# EasyEDA schematic 1-Schematic_5G8038.json
TITLE: 5G8038; REV: 1.0; Date: 2022-07-19; Sheet: 1/1; Drawn By: BH2VGM; Company: NEU-ISE
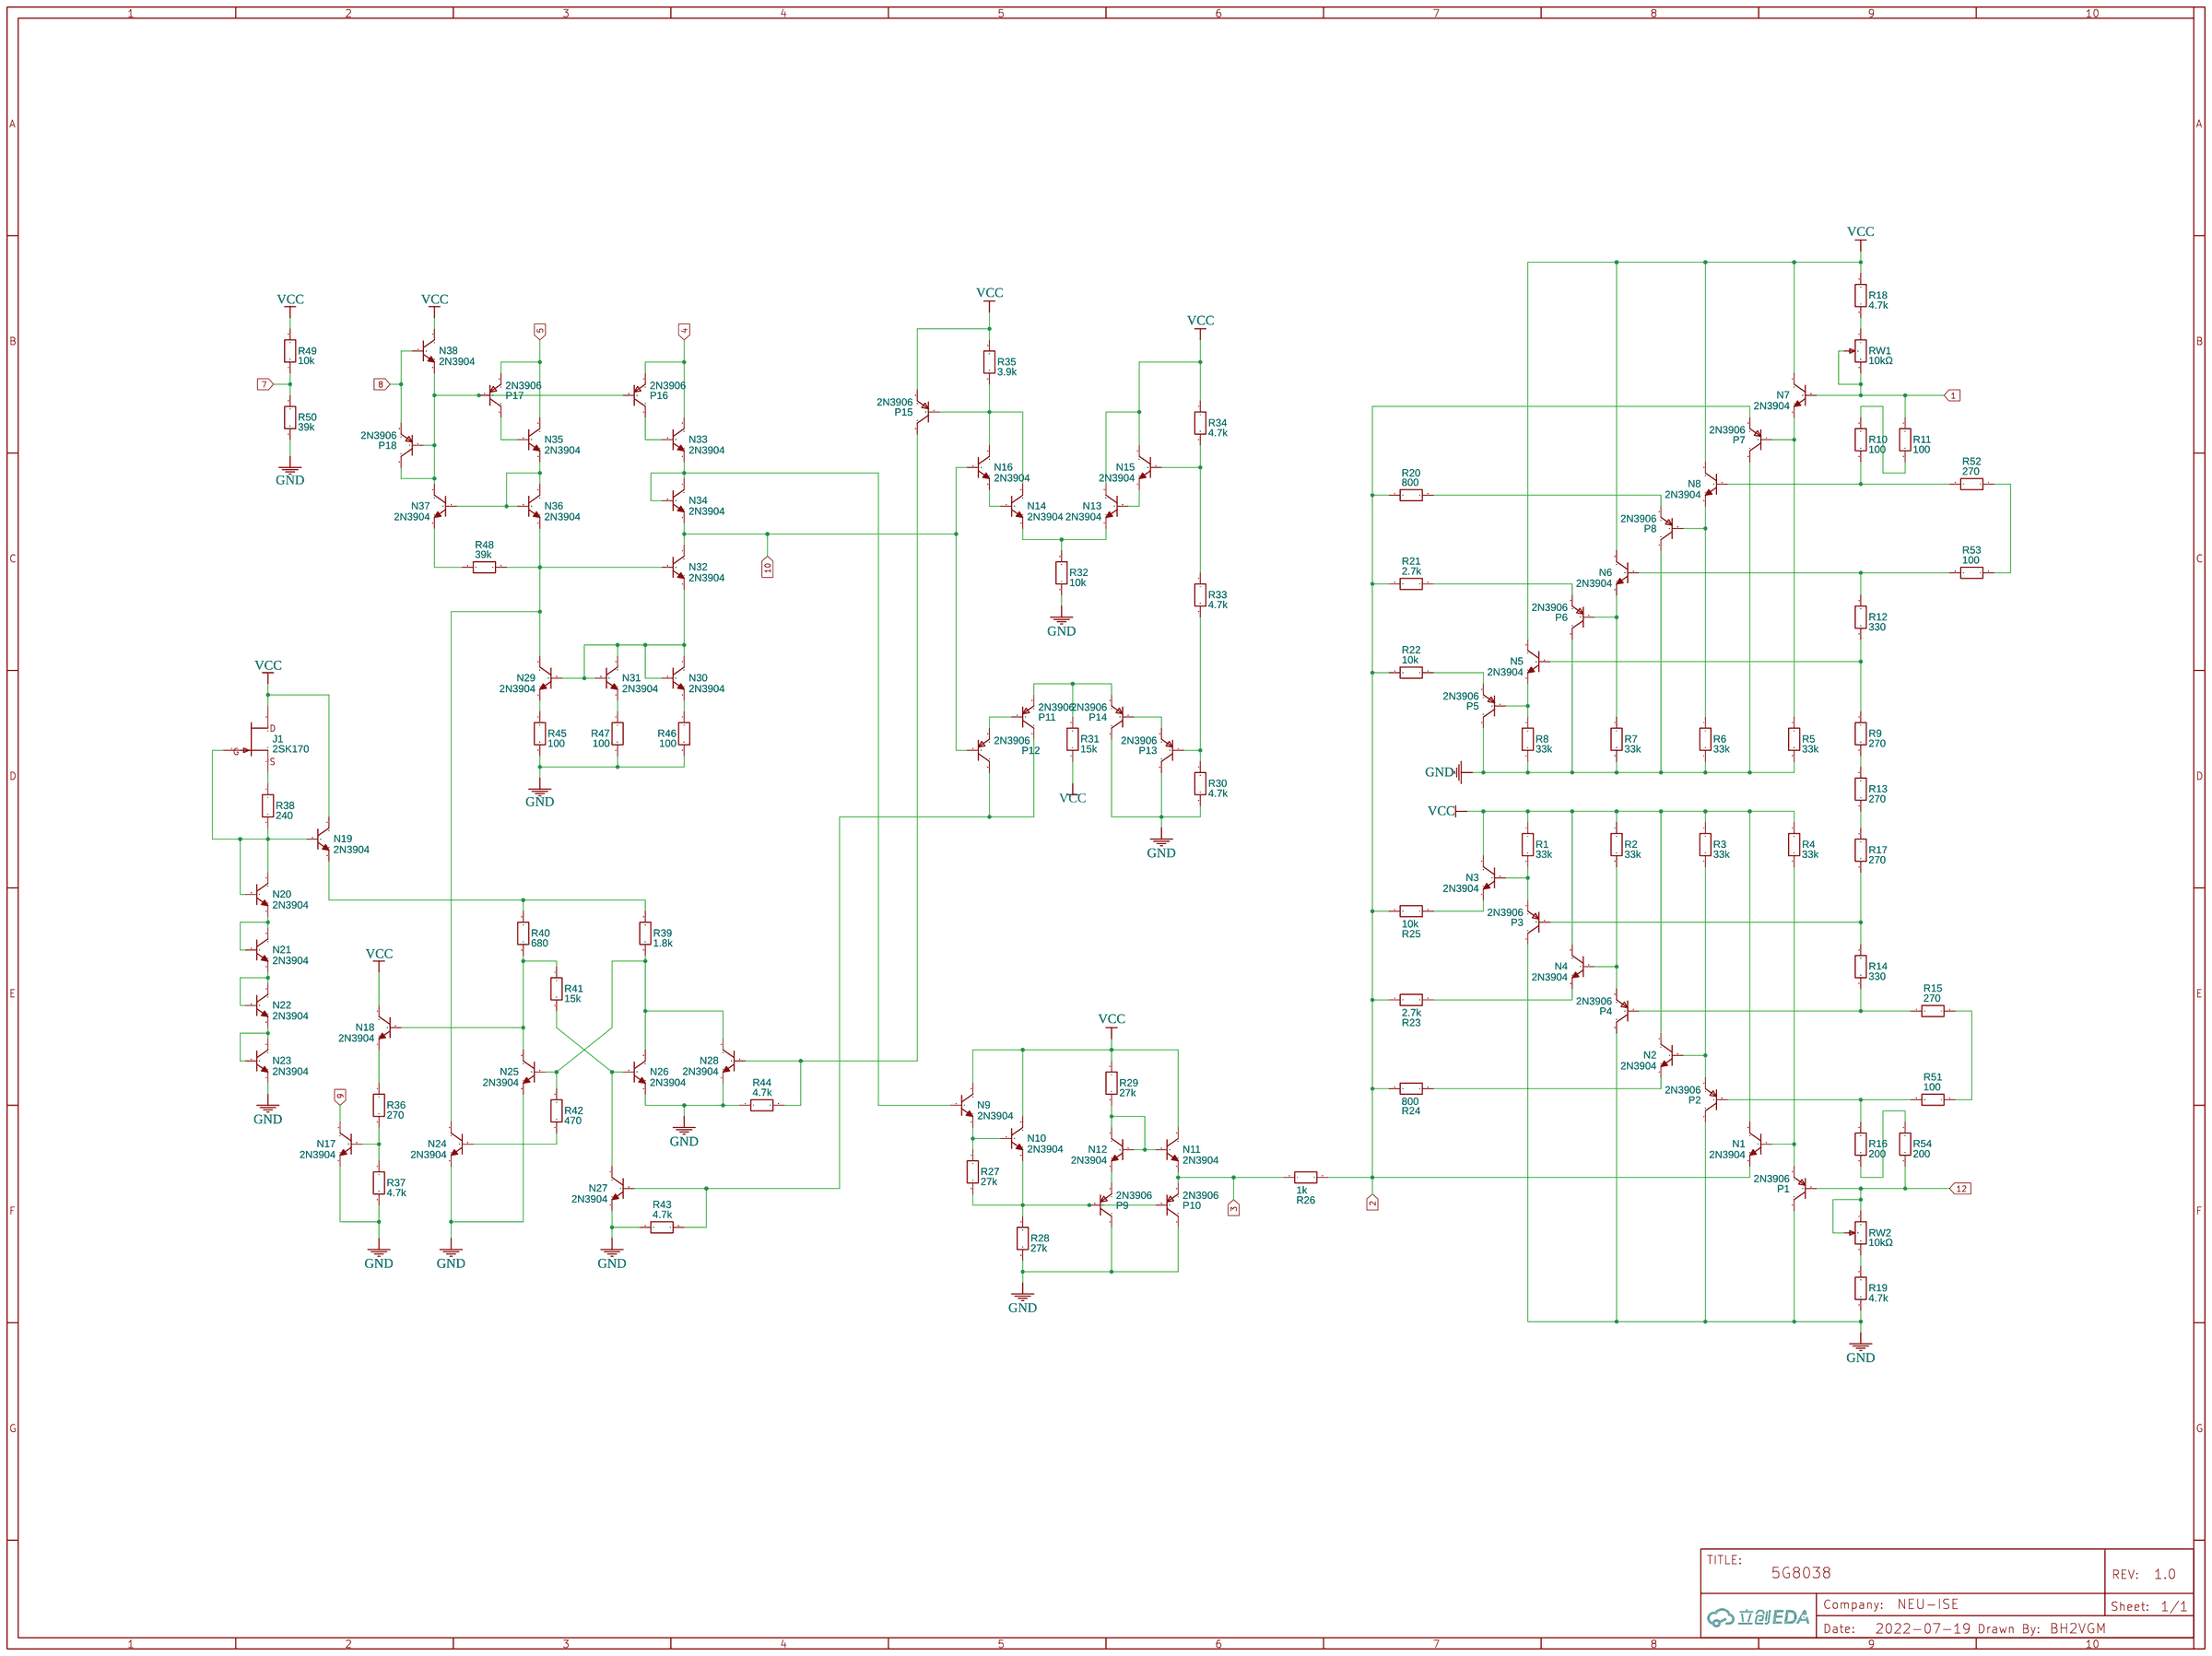
[diagram p0: schematic sheet]

## Parts
J1  2SK170  [2SK170]
N1  2N3904  [TO-92-3]
N2  2N3904  [TO-92-3]
N3  2N3904  [TO-92-3]
N4  2N3904  [TO-92-3]
N5  2N3904  [TO-92-3]
N6  2N3904  [TO-92-3]
N7  2N3904  [TO-92-3]
N8  2N3904  [TO-92-3]
N9  2N3904  [TO-92-3]
N10  2N3904  [TO-92-3]
N11  2N3904  [TO-92-3]
N12  2N3904  [TO-92-3]
N13  2N3904  [TO-92-3]
N14  2N3904  [TO-92-3]
N15  2N3904  [TO-92-3]
N16  2N3904  [TO-92-3]
N17  2N3904  [TO-92-3]
N18  2N3904  [TO-92-3]
N19  2N3904  [TO-92-3]
N20  2N3904  [TO-92-3]
N21  2N3904  [TO-92-3]
N22  2N3904  [TO-92-3]
N23  2N3904  [TO-92-3]
N24  2N3904  [TO-92-3]
N25  2N3904  [TO-92-3]
N26  2N3904  [TO-92-3]
N27  2N3904  [TO-92-3]
N28  2N3904  [TO-92-3]
N29  2N3904  [TO-92-3]
N30  2N3904  [TO-92-3]
N31  2N3904  [TO-92-3]
N32  2N3904  [TO-92-3]
N33  2N3904  [TO-92-3]
N34  2N3904  [TO-92-3]
N35  2N3904  [TO-92-3]
N36  2N3904  [TO-92-3]
N37  2N3904  [TO-92-3]
N38  2N3904  [TO-92-3]
P1  2N3906  [TO-92-3]
P2  2N3906  [TO-92-3]
P3  2N3906  [TO-92-3]
P4  2N3906  [TO-92-3]
P5  2N3906  [TO-92-3]
P6  2N3906  [TO-92-3]
P7  2N3906  [TO-92-3]
P8  2N3906  [TO-92-3]
P9  2N3906  [TO-92-3]
P10  2N3906  [TO-92-3]
P11  2N3906  [TO-92-3]
P12  2N3906  [TO-92-3]
P13  2N3906  [TO-92-3]
P14  2N3906  [TO-92-3]
P15  2N3906  [TO-92-3]
P16  2N3906  [TO-92-3]
P17  2N3906  [TO-92-3]
P18  2N3906  [TO-92-3]
R1  33k  [1/4W-8.1MM]
R2  33k  [1/4W-8.1MM]
R3  33k  [1/4W-8.1MM]
R4  33k  [1/4W-8.1MM]
R5  33k  [1/4W-8.1MM]
R6  33k  [1/4W-8.1MM]
R7  33k  [1/4W-8.1MM]
R8  33k  [1/4W-8.1MM]
R9  270  [1/4W-8.1MM]
R10  100  [1/4W-8.1MM]
R11  100  [1/4W-8.1MM]
R12  330  [1/4W-8.1MM]
R13  270  [1/4W-8.1MM]
R14  330  [1/4W-8.1MM]
R15  270  [1/4W-8.1MM]
R16  200  [1/4W-8.1MM]
R17  270  [1/4W-8.1MM]
R18  4.7k  [1/4W-8.1MM]
R19  4.7k  [1/4W-8.1MM]
R20  800  [1/4W-8.1MM]
R21  2.7k  [1/4W-8.1MM]
R22  10k  [1/4W-8.1MM]
R23  2.7k  [1/4W-8.1MM]
R24  800  [1/4W-8.1MM]
R25  10k  [1/4W-8.1MM]
R26  1k  [1/4W-8.1MM]
R27  27k  [1/4W-8.1MM]
R28  27k  [1/4W-8.1MM]
R29  27k  [1/4W-8.1MM]
R30  4.7k  [1/4W-8.1MM]
R31  15k  [1/4W-8.1MM]
R32  10k  [1/4W-8.1MM]
R33  4.7k  [1/4W-8.1MM]
R34  4.7k  [1/4W-8.1MM]
R35  3.9k  [1/4W-8.1MM]
R36  270  [1/4W-8.1MM]
R37  4.7k  [1/4W-8.1MM]
R38  240  [1/4W-8.1MM]
R39  1.8k  [1/4W-8.1MM]
R40  680  [1/4W-8.1MM]
R41  15k  [1/4W-8.1MM]
R42  470  [1/4W-8.1MM]
R43  4.7k  [1/4W-8.1MM]
R44  4.7k  [1/4W-8.1MM]
R45  100  [1/4W-8.1MM]
R46  100  [1/4W-8.1MM]
R47  100  [1/4W-8.1MM]
R48  39k  [1/4W-8.1MM]
R49  10k  [1/4W-8.1MM]
R50  39k  [1/4W-8.1MM]
R51  100  [1/4W-8.1MM]
R52  270  [1/4W-8.1MM]
R53  100  [1/4W-8.1MM]
R54  200  [1/4W-8.1MM]
RW1  10kΩ  [3296W 10ROUND]
RW2  10kΩ  [3296W 10ROUND]

## Library data of the parts
J1 = 2SK170: Contributor: king13478509115
N1-N38 = 2N3904: Supplier: LCSC; Manufacturer: SEMTECH; Supplier Part: C118538; JLCPCB Part Class: Extended Part; Contributor: king13478509115
P1-P18 = 2N3906: Supplier: LCSC; Manufacturer: CJ; Supplier Part: C9809; JLCPCB Part Class: Extended Part; Contributor: king13478509115
R1-R54 = 1/4W电阻: Contributor: king13478509115
RW1 RW2 = 3296W: Supplier: LCSC; Manufacturer: BOURNS; Manufacturer Part: 3296W-1-103LF; Supplier Part: C34846; Resistance(Ohms): 10K; Resistance (Ohms): 10K; JLCPCB Part Class: Extended Part; Contributor: king13478509115

## Nets
GND: N17.e(E) N23.e(E) N24.e(E) N25.e(E) N26.e(E) N27.e(E) N28.e(E) P1.c(C) P2.c(C) P3.c(C) P4.c(C) P5.c(C) P6.c(C) P7.c(C) P8.c(C) P9.c(C) P10.c(C) P13.c(C) P14.c(C) R5.2 R6.2 R7.2 R8.2 R19.1 R28.2 R30.2 R32.1 R37.2 R43.1 R44.1 R45.2 R46.2 R47.2 R50.1
VCC: J1.3(D) N1.c(C) N2.c(C) N3.c(C) N4.c(C) N5.c(C) N6.c(C) N7.c(C) N8.c(C) N9.c(C) N10.c(C) N11.c(C) N13.c(C) N15.c(C) N18.c(C) N19.c(C) N38.c(C) P15.e(E) R1.1 R2.1 R3.1 R4.1 R18.1 R29.1 R31.1 R34.1 R35.1 R49.2
1: N7.b(B) R11.1 RW1.2 RW1.3
2: N1.e(E) P7.e(E) R20.1 R21.1 R22.1 R23.1 R24.1 R25.1 R26.2
3: N11.e(E) P10.e(E) R26.1
4: N33.c(C) P16.e(E)
5: N35.c(C) P17.e(E)
7: R49.1 R50.2
8: N38.b(B) P18.e(E)
9: N17.c(C)
10: N16.b(B) N32.c(C) N34.e(E) P12.b(B)
12: P1.b(B) R54.1 RW2.1 RW2.2
Net-(J1-1): J1.1(S) R38.1
Net-(J1-2): J1.2(G) N19.b(B) N20.b(B) N20.c(C) R38.2
Net-(N1-b): N1.b(B) P1.e(E) R4.2
Net-(N2-b): N2.b(B) P2.e(E) R3.2
Net-(N2-e): N2.e(E) R24.2
Net-(N3-b): N3.b(B) P3.e(E) R1.2
Net-(N3-e): N3.e(E) R25.2
Net-(N4-b): N4.b(B) P4.e(E) R2.2
Net-(N4-e): N4.e(E) R23.2
Net-(N5-b): N5.b(B) R9.1 R12.2
Net-(N5-e): N5.e(E) P5.b(B) R8.1
Net-(N6-b): N6.b(B) R12.1 R53.2
Net-(N6-e): N6.e(E) P6.b(B) R7.1
Net-(N7-e): N7.e(E) P7.b(B) R5.1
Net-(N8-b): N8.b(B) R10.2 R52.2
Net-(N8-e): N8.e(E) P8.b(B) R6.1
Net-(N9-b): N9.b(B) N33.e(E) N34.b(B) N34.c(C)
Net-(N9-e): N9.e(E) N10.b(B) R27.1
Net-(N10-e): N10.e(E) P9.b(B) P10.b(B) R27.2 R28.1
Net-(N11-b): N11.b(B) N12.b(B) N12.c(C) R29.2
Net-(N12-e): N12.e(E) P9.e(E)
Net-(N13-b): N13.b(B) N15.e(E)
Net-(N13-e): N13.e(E) N14.e(E) R32.2
Net-(N14-b): N14.b(B) N16.e(E)
Net-(N14-c): N14.c(C) N16.c(C) P15.b(B) R35.2
Net-(N15-b): N15.b(B) R33.1 R34.2
Net-(N17-b): N17.b(B) R36.2 R37.1
Net-(N18-b): N18.b(B) N25.c(C) R40.2 R41.1
Net-(N18-e): N18.e(E) R36.1
Net-(N19-e): N19.e(E) R39.1 R40.1
Net-(N20-e): N20.e(E) N21.b(B) N21.c(C)
Net-(N21-e): N21.e(E) N22.b(B) N22.c(C)
Net-(N22-e): N22.e(E) N23.b(B) N23.c(C)
Net-(N24-b): N24.b(B) R42.2
Net-(N24-c): N24.c(C) N29.c(C) N32.b(B) N36.e(E) R48.2
Net-(N25-b): N25.b(B) N26.c(C) N28.c(C) R39.2 R42.1
Net-(N26-b): N26.b(B) N27.c(C) R41.2
Net-(N27-b): N27.b(B) P11.c(C) P12.c(C) R43.2
Net-(N28-b): N28.b(B) P15.c(C) R44.2
Net-(N29-b): N29.b(B) N30.b(B) N30.c(C) N31.b(B) N31.c(C) N32.e(E)
Net-(N29-e): N29.e(E) R45.1
Net-(N30-e): N30.e(E) R46.1
Net-(N31-e): N31.e(E) R47.1
Net-(N33-b): N33.b(B) P16.c(C)
Net-(N35-b): N35.b(B) P17.c(C)
Net-(N35-e): N35.e(E) N36.b(B) N36.c(C) N37.b(B)
Net-(N37-c): N37.c(C) N38.e(E) P16.b(B) P17.b(B) P18.b(B) P18.c(C)
Net-(N37-e): N37.e(E) R48.1
Net-(P2-b): P2.b(B) R16.2 R51.2
Net-(P3-b): P3.b(B) R14.2 R17.2
Net-(P4-b): P4.b(B) R14.1 R15.2
Net-(P5-e): P5.e(E) R22.2
Net-(P6-e): P6.e(E) R21.2
Net-(P8-e): P8.e(E) R20.2
Net-(P11-b): P11.b(B) P12.e(E)
Net-(P11-e): P11.e(E) P14.e(E) R31.2
Net-(P13-b): P13.b(B) R30.1 R33.2
Net-(P13-e): P13.e(E) P14.b(B)
Net-(R9-2): R9.2 R13.1
Net-(R10-1): R10.1 R11.2
Net-(R13-2): R13.2 R17.1
Net-(R15-1): R15.1 R51.1
Net-(R16-1): R16.1 R54.2
Net-(R18-2): R18.2 RW1.1
Net-(R19-2): R19.2 RW2.3
Net-(R52-1): R52.1 R53.1
